# Altium project Project1.PrjPcb
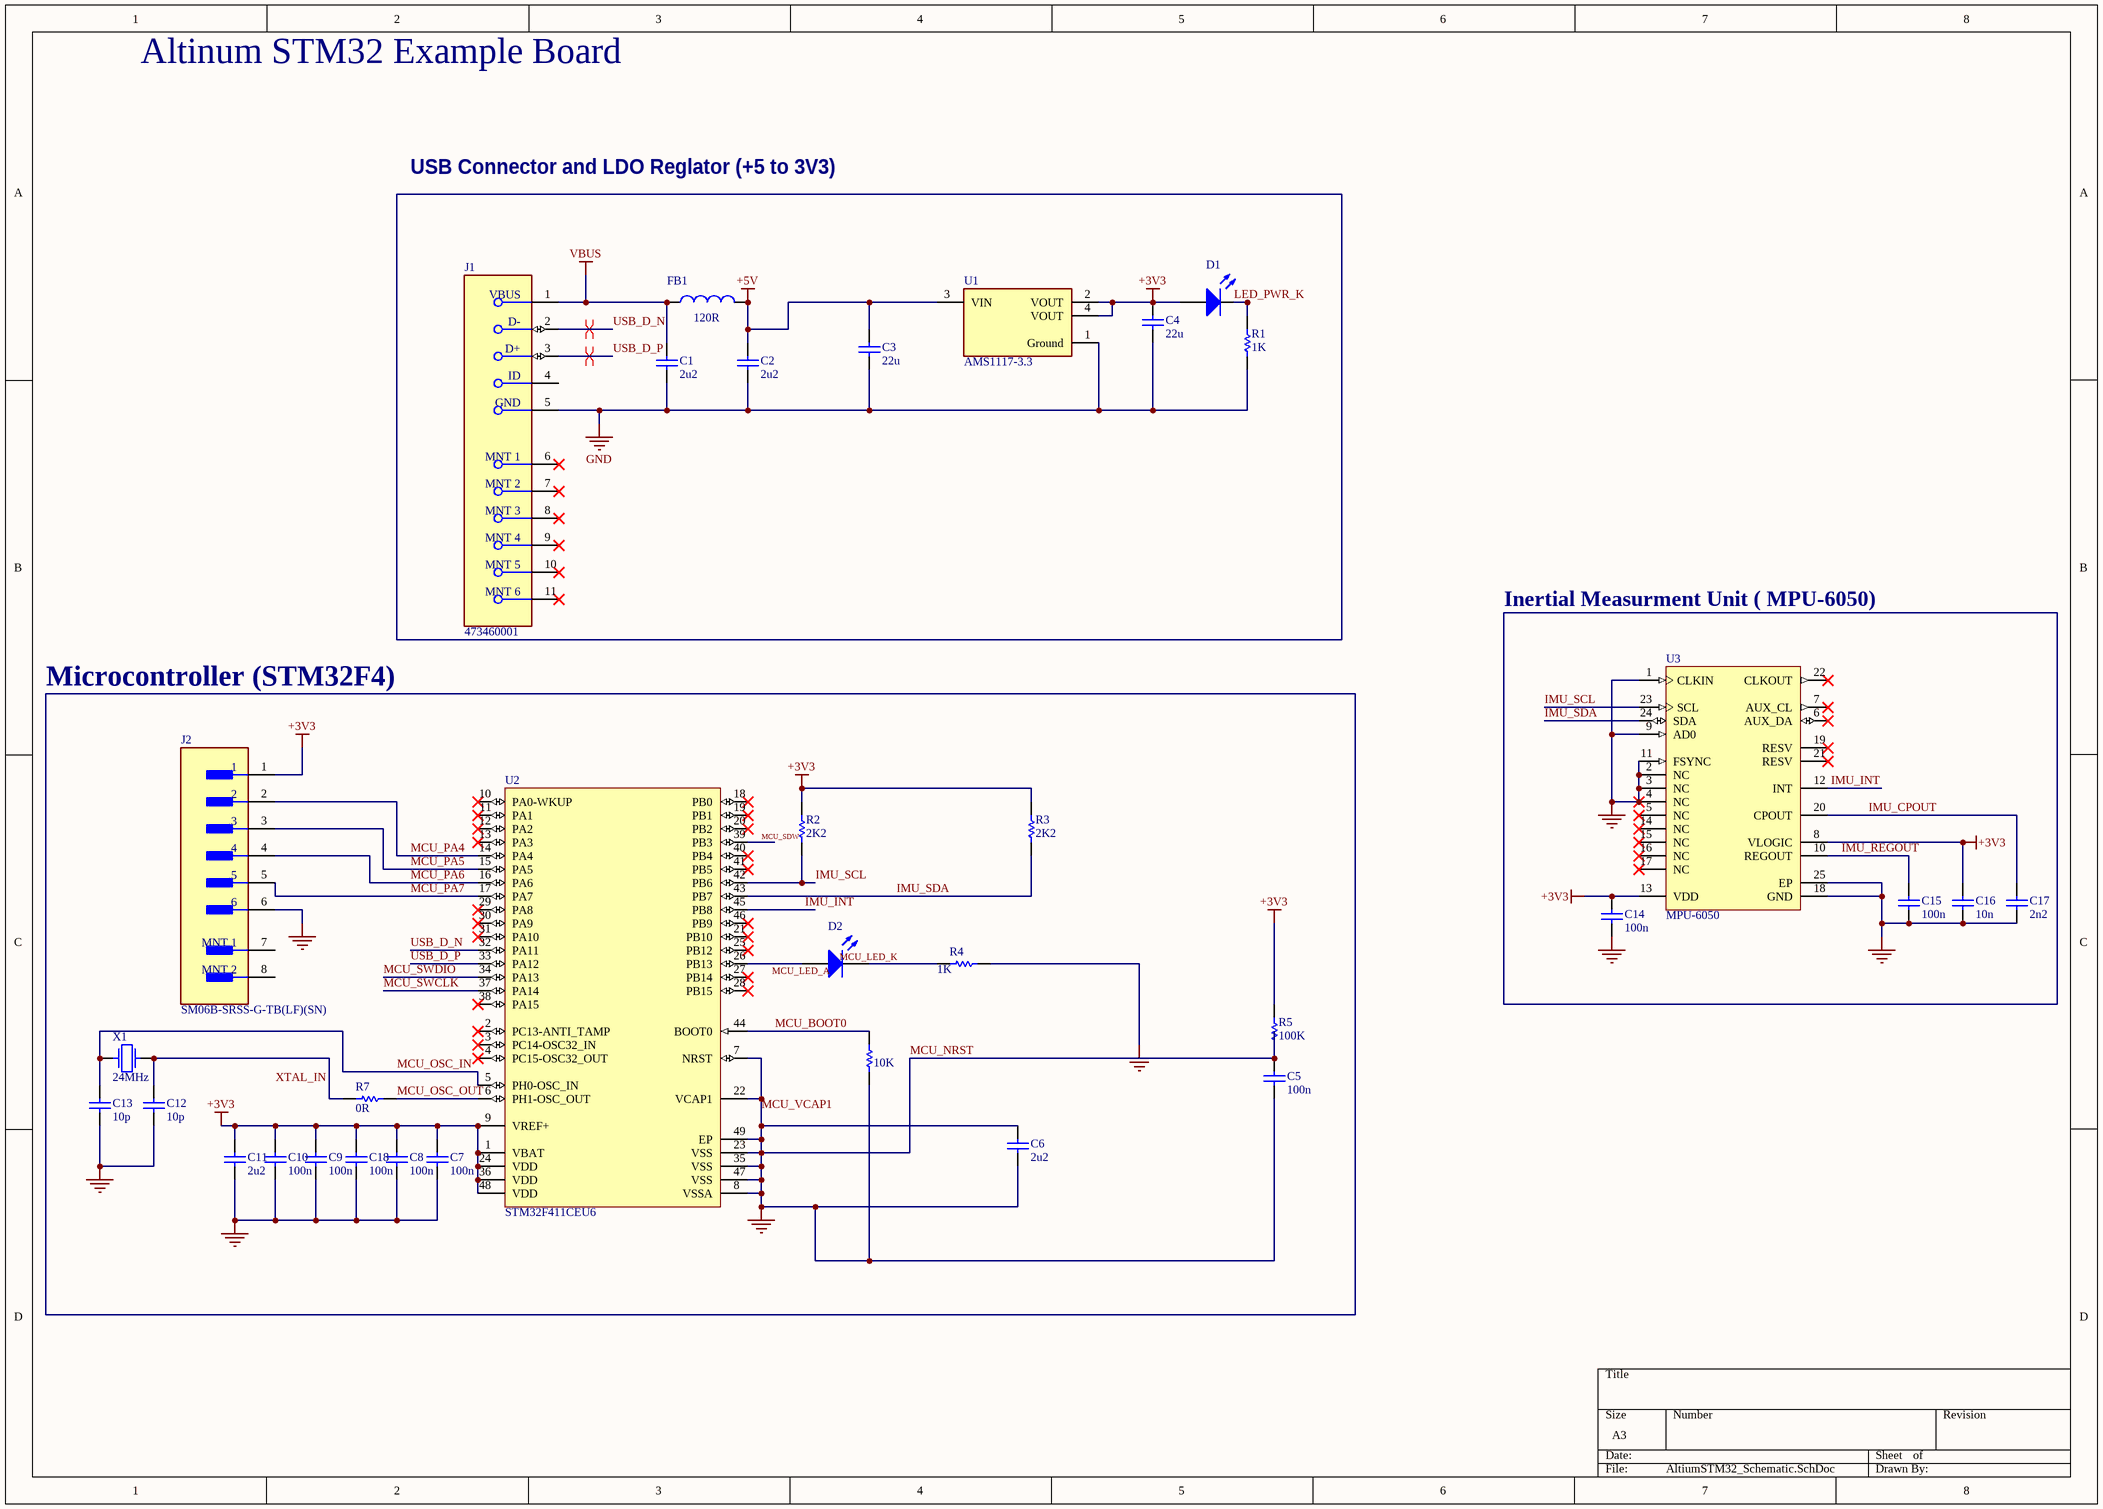
[diagram p0: AltiumSTM32_Schematic.SchDoc]
1 sheet, 34 parts. Net scope: global (net labels, ports and power ports of the same name join across sheets).
Board file: PCB1.PcbDoc

## Sheet AltiumSTM32_Schematic.SchDoc
size A3; SheetNumber: 1; SheetTotal: 1

### Parts
C1  value 2u2  (hidden comment: Capacitor)
C2  value 2u2  (hidden comment: Capacitor)
C3  value 22u  (hidden comment: Capacitor)
C4  value 22u  (hidden comment: Capacitor)
C5  value 100n  (hidden comment: Capacitor)
C6  value 2u2  (hidden comment: Capacitor)
C7  value 100n  (hidden comment: Capacitor)
C8  value 100n  (hidden comment: Capacitor)
C9  value 100n  (hidden comment: Capacitor)
C10  value 100n  (hidden comment: Capacitor)
C11  value 2u2  (hidden comment: Capacitor)
C12  value 10p  (hidden comment: Capacitor)
C13  value 10p  (hidden comment: Capacitor)
C14  value 100n  (hidden comment: Capacitor)
C15  value 100n  (hidden comment: Capacitor)
C16  value 10n  (hidden comment: Capacitor)
C17  value 2n2  (hidden comment: Capacitor)
C18  value 100n  (hidden comment: Capacitor)
D1  Light-Emitting Diode  (value not drawn)
D2  Light-Emitting Diode  (value not drawn)
FB1  120R  [WE-CBF HF_0603_HC]
J1  473460001  [FP-473460001-MFG]
J2  SM06B-SRSS-G-TB(LF)(SN)  [FP-SM06B-SRSS-G-TB_LF_SN-MFG]
R1  value 1K  (hidden comment: Resistor)
R2  value 2K2  (hidden comment: Resistor)
R3  value 2K2  (hidden comment: Resistor)
R4  value 1K  (hidden comment: Resistor)
R5  value 100K  (hidden comment: Resistor)
R7  value 0R  (hidden comment: Resistor)
U1  AMS1117-3.3  [FP-AMS1117-IPC_C]
U2  STM32F411CEU6  [STM-UFQFPN48_L]
U3  MPU-6050  [IS-QFN-24_V]
X1  F0: 24MHz  (hidden comment: Crystal)
  value 10K  (hidden comment: Resistor)

### Nets
+3V3: C4.2 C7.2 C8.2 C9.2 C10.2 C11.2 C14.2 C16.2 C18.2 D1.1(A) J2.1 R2.2 R3.2 R5.2 U1.2(VOUT) U1.4(VOUT) U2.1(VBAT) U2.9(VREF+) U2.24(VDD) U2.36(VDD) U2.48(VDD) U3.8(VLOGIC) U3.13(VDD)
+5V: C2.2 C3.2 FB1.2 U1.3(VIN)
MCU_NRST: C1.1 C2.1 C3.1 C4.1 C5.1 C5.2 C6.1 C6.2 C7.1 C8.1 C9.1 C10.1 C11.1 C12.1 C13.1 C14.1 C15.1 C16.1 C17.1 C18.1 J1.5(GND) J2.6 R1.1 R4.2 R5.1 U1.1(Ground) U2.7(NRST) U2.8(VSSA) U2.22(VCAP1) U2.23(VSS) U2.35(VSS) U2.47(VSS) U2.49(EP) U3.1(CLKIN) U3.2(NC) U3.3(NC) U3.4(NC) U3.9(AD0) U3.11(FSYNC) U3.18(GND) U3.25(EP) .1  [also labelled GND, MCU_VCAP1]
VBUS: C1.2 FB1.1 J1.1(VBUS)
IMU_CPOUT: C17.2 U3.20(CPOUT)
IMU_INT: U3.12(INT)
IMU_REGOUT: C15.2 U3.10(REGOUT)
IMU_SCL: R2.1 U2.42(PB6) U3.23(SCL)
IMU_SDA: R3.1 U2.43(PB7) U3.24(SDA)
LED_PWR_K: D1.2(K) R1.2
MCU_BOOT0: U2.44(BOOT0) .2
MCU_LED_A: D2.1(A) U2.26(PB13)
MCU_LED_K: D2.2(K) R4.1
MCU_OSC_IN: C13.2 U2.5(PH0-OSC_IN) X1.1
MCU_OSC_OUT: R7.2 U2.6(PH1-OSC_OUT)
MCU_PA4: J2.2 U2.14(PA4)
MCU_PA5: J2.3 U2.15(PA5)
MCU_PA6: J2.4 U2.16(PA6)
MCU_PA7: J2.5 U2.17(PA7)
MCU_SDW: U2.39(PB3)
MCU_SWCLK: U2.37(PA14)
MCU_SWDIO: U2.34(PA13)
USB_D_N: J1.2(D-) U2.32(PA11)
USB_D_P: J1.3(D+) U2.33(PA12)
NetC12_2: C12.2 R7.1 X1.2

Not connected (* = marked no-connect by the designer): J1 4(ID) 6(MNT_1)* 7(MNT_2)* 8(MNT_3)* 9(MNT_4)* 10(MNT_5)* 11(MNT_6)*; J2 7(MNT_1) 8(MNT_2); U2 2(PC13-ANTI_TAMP)* 3(PC14-OSC32_IN)* 4(PC15-OSC32_OUT)* 10(PA0-WKUP)* 11(PA1)* 12(PA2)* 13(PA3)* 18(PB0)* 19(PB1)* 20(PB2)* 21(PB10)* 25(PB12)* 27(PB14)* 28(PB15)* 29(PA8)* 30(PA9)* 31(PA10)* 38(PA15)* 40(PB4)* 41(PB5)* 45(PB8) 46(PB9)*; U3 5(NC)* 6(AUX_DA)* 7(AUX_CL)* 14(NC)* 15(NC)* 16(NC)* 17(NC)* 19(RESV)* 21(RESV)* 22(CLKOUT)*

### Layout directives
differential pair; differential pair class DIFF_USB: USB_D_N, USB_D_P

### Notes on the sheet
- Altinum STM32 Example Board
- USB Connector and LDO Reglator (+5 to 3V3) <v >
- Inertial Measurment Unit ( MPU-6050)
- Microcontroller (STM32F4)
- Labels drawn without touching a wire or pin: IMU_INT, XTAL_IN

### Library data of the parts
C1-C18 = Capacitor: SimulationGenericComponent: True
D1 D2 = LED: AF: 1; BV: 0; BV_MAX: 1e99; EG: 1.11; FC: 0.5; IBV: 0.001; IS: 1e-14; MJSW: 0.33; NTUN: 30; TNOM: 27; XTI: 3; SimulationGenericComponent: True; CJO: 0; CJP: 0; CTA: 0; CTP: 0; FCS: 0.5; FV_MAX: 1e99; IKF: 0; IKR: 0; ISR: 1e-14; JSW: 0; JTUN: 0; JTUNSW: 0; KEG: 1; KF: 0; LEVEL: 1; N: 1; NBV: 1; NR: 1; NS: 1; PHP: 1; RS: 0; TCV: 0; TLEV: 0; TLEVC: 0; TM1: 0; TM2: 0; TPB: 0; TPHP: 0; TRS: 0; TRS2: 0; TT: 0; TTT1: 0; TTT2: 0; VJ: 1; XTITUN: 3
FB1 = CMP-0220-00101-3: Ferrite Bead (emi Suppression), 1.6X0.8X0.8MM (0603), 600O Impedance At 100 Mhz; Current Rating: 400mA; DC Resistance (DCR): 220mΩ; Max Current Rating: 500mA; Impedance: 600Ω; Tolerance: 25%; Resistance: 350mΩ; Number of Lines: 1; Test Frequency: 100MHz; Height: 800µm; Min Operating Temperature: -55°C; Length: 1.6mm; Width: 800µm; Case Code (Imperial): 0603; Depth: 800µm; Number of Pins: 2; Case Code (Metric): 1608; Case/Package: SMD/SMT; Lead Free: Lead Free; Core Material: Ferrite; Max Operating Temperature: 125°C; Termination: SMD/SMT; RoHS: Compliant; REACH SVHC: Unknown; Max DC Current: 500mA; Mount: Surface Mount
J1 = CMP-2000-05246-2: CONN RCPT USB2.0 MICRO B SMD R/A; Manufacturer: Molex; Conn Orientation: Right Angle; Is Female: yes; Shielding: true; Pitch: 0.65mm; Number Of Contacts: 5; Voltage Rating: 30V; Current Rating: 1.8A; Device Class L2: USB Connectors; Digikey Description: CONN RCPT USB2.0 MICRO B SMD R/A; Height: 2.945mm; RoHS: TRUE; ComponentLink2Description: Datasheet; Octopart: https://octopart.com/47346-0001-molex-7164928; Automotive: No; Package: 0; Category: Conn; Device Class L1: Connectors; Usb Standard: USB 2.0; Temperature: -30°C to +85°C; Temperature Range Low: -30°C; Footprint Url: https://www.molex.com/pdm_docs/sd/473460001_sd.pdf; ComponentLink2URL: https://www.molex.com/webdocs/datasheets/pdf/en-us/0473460001_IO_CONNECTORS.pdf; Lead Free: Yes; Manufacturer Part Number: 473460001; Contact Material: Gold,Nickel; Temperature Range High: +85°C; Device Class L3: unset
J2 = CMP-17439-000248-1: 6 Circuit Side Entry Shrouded SR Header; Lead Free: Lead Free; Connector Type: Header
R1-R5 R7  = Resistor: TC1: 0; SimulationGenericComponent: True; TC2: 0
U1 = CMP-209535-000001-1: LDO Voltage Regulators 1A, 3.3V; Manufacturer: Advanced Monolithic Systems; Dropout Voltage: 1.1V; Output Type: Fixed; Nominal Supply Current: 5mA; Max Power Dissipation: 1.2W; Max Supply Voltage: 15V; Number Of Outputs: 1; Standoff Height: 0.64mm; Max Junction Temp: +125°C; Height: 1.8mm; Package: AMS1117; Device Class L2: Power Management ICs; ComponentLink2Description: Datasheet; ComponentLink2URL: http://www.advanced-monolithic.com/pdf/ds1117.pdf; Category: IC; RoHS: TRUE; Automotive: No; Device Class L1: Integrated Circuits (ICs); Output Current: 1A; Device Class L3: Voltage Regulators - Linear; Temperature: -40°C to +125°C; Output Voltage: 3.3V; Manufacturer Part Number: AMS1117-3.3; Temperature Range Low: -40°C; Octopart: https://octopart.com/ams1117-3.3-advanced+monolithic+systems-25899300; Lead Free: Yes; Ipc Land Pattern Name: SOT229P700X180-4; Temperature Range High: +125°C
U2 = CMP-0243-00165-1: ARM Cortex-M4 32-bit MCU+FPU, 512 KB Flash, 128 KB RAM, 36 I/Os, 48-Pin UFQFPN, -40 to 85 degC, Tray; Operating Frequency(F) (Processor speed) (MHz): 100; FLASH Size (Prog) (kB): 512; Internal RAM Size (kB): 128; I/Os (High Current): 36; Supply Voltage(Vcc) min (V): 1.7; Package Reference: 48-Pin Ultra Thin Fine Pitch Quad Flat No-Lead, 7 x 7 x 0.6 mm Body, 0.5 mm Pitch, Exposed Pad; ComponentLink1Description: Manufacturer URL; ComponentLink1URL: http://www.st.com/; Packing: Tray; Package Description: UFQFPN48; Core: ARM Cortex-M4; ComponentLink2Description: Datasheet; ComponentLink2URL: http://www.st.com/st-web-ui/static/active/en/resource/technical/document/datasheet/DM00115249.pdf; DatasheetVersion: Rev. 6; Mounting Technology: Surface Mount
U3 = CMP-1753-00002-2: 3-Axis Gyroscope, Accelerometer and a Digital Motion Processor(TM) (DMP), 2.375 to 3.46 V, -40 to 85 degC, 24-Pin QFN, RoHS, Tape and Reel; Manufacturer: InvenSense; Featured Product: MPU-60506-Axis,IntegratedI²CSolution; Other Names: 1428-1007-2 / MPU6050; Sensor Type: MotionTracking; Online Catalog: MPU-6000™Series; Unit PriceUSD: Digital; Datasheet Version: Rev. 3.3, 05/2012; Category: Sensors,Transducers; Datasheet URL: http://datasheet.octopart.com/MPU-6050-InvenSense-datasheet-14421344.pdf; Family: Multifunction; Standard Package: 5,000; Manufacturer URL: http://www.invensense.com/; Output Type: Digital; Dynamic Catalog: MPU-6000™Series
X1 = Crystal: R: 500; Q: 50K; SimulationGenericComponent: True